# Altium schematic sheet pca10040_sheet4_connectors.SchDoc: PCA10040 - Connectors
size A3; Revision: 1.1.1; SheetNumber: 4; SheetTotal: 5; DrawnBy: KJP; ProjectNumber: 4397; PCAName: PCA10040; PCBRevision: 0071KJP; DocumentSize: A3; PCBNumber: 400150; ProjectName: Quark
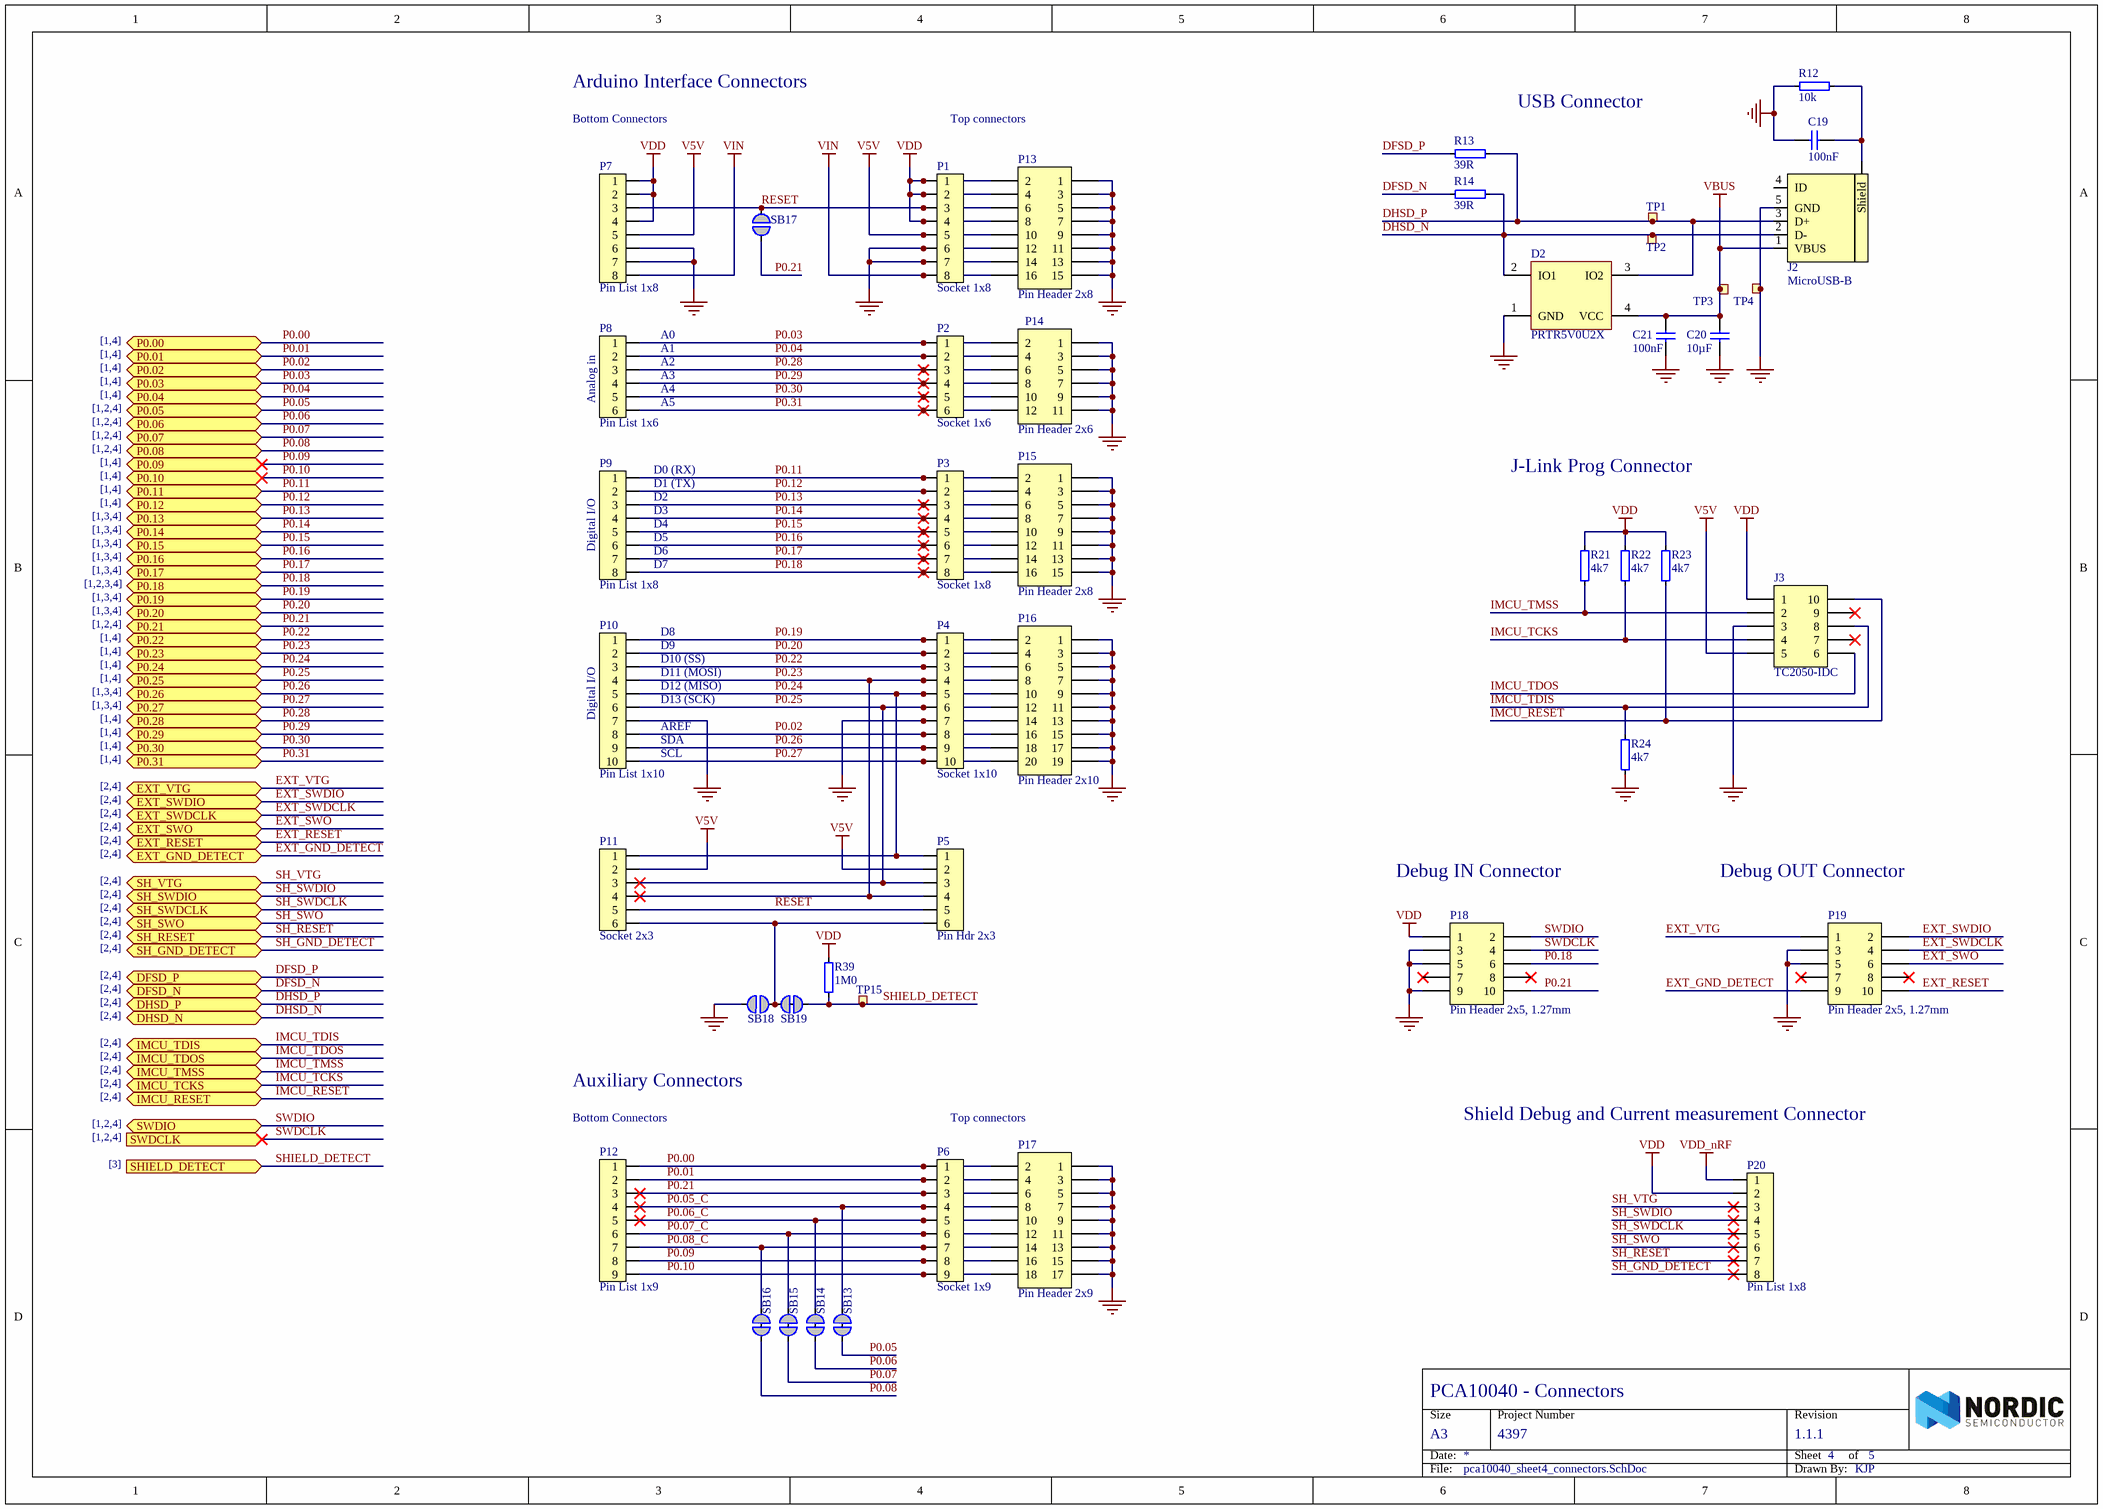
[diagram p0: pca10040_sheet4_connectors.SchDoc]

## Parts
C19  100nF  [CAPC1005X04L]
C20  10µF  [CAPC1608X06L]
C21  100nF  [CAPC1005X04L]
D2  PRTR5V0U2X  [SOT190P230X110-4L]
J2  MicroUSB-B  [USB-Micro-B-RA-SMD-PiP]
J3  TC2050-IDC  [TC2050-IDC-NLFP]  (no BOM)
P1  Socket 1x8  [SOCKET_1x8_SMD]
P2  Socket 1x6  [SOCKET_1x6_SMD]
P3  Socket 1x8  [SOCKET_1x8_SMD]
P4  Socket 1x10  [SOCKET_1x10_SMD]
P5  Pin Hdr 2x3  [HDR_2x3-SMD]
P6  Socket 1x9  [SOCKET_1x9_SMD]
P7  Pin List 1x8  [LIST_1x8_SMD]
P8  Pin List 1x6  [LIST_1x6_SMD]
P9  Pin List 1x8  [LIST_1x8_SMD]
P10  Pin List 1x10  [LIST_1x10_SMD]
P11  Socket 2x3  [SOCKET_2x3_SMD-2.54mm-bottom]
P12  Pin List 1x9  [LIST_1x9_SMD]
P13  Pin Header 2x8  [HDR_2x8]
P14  Pin Header 2x6  [HDR_2x6]
P15  Pin Header 2x8  [HDR_2x8]
P16  Pin Header 2x10  [HDR_2x10]
P17  Pin Header 2x9  [HDR_2x9]
P18  Pin Header 2x5, 1.27mm  [HDR_2x5-SMD-1.27mm-K]
P19  Pin Header 2x5, 1.27mm  [HDR_2x5-SMD-1.27mm-K]
P20  Pin List 1x8  [LIST_1x8_SMD]
R12  10k  [RESC1005X04L]
R13  39R  [RESC1005X04L]
R14  39R  [RESC1005X04L]
R21  4k7  [RESC1005X04L]
R22  4k7  [RESC1005X04L]
R23  4k7  [RESC1005X04L]
R24  4k7  [RESC1005X04L]
R39  1M0  [RESC1005X04L]
SB13  Solderbridge  [Solderbridge_Shorted]  (value not drawn)  (net tie, no BOM)
SB14  Solderbridge  [Solderbridge_Shorted]  (value not drawn)  (net tie, no BOM)
SB15  Solderbridge  [Solderbridge_Shorted]  (value not drawn)  (net tie, no BOM)
SB16  Solderbridge  [Solderbridge_Shorted]  (value not drawn)  (net tie, no BOM)
SB17  Solderbridge  [Solderbridge]  (value not drawn)  (no BOM)
SB18  Solderbridge  [Solderbridge]  (value not drawn)  (no BOM)
SB19  Solderbridge  [Solderbridge_Shorted]  (value not drawn)  (net tie, no BOM)
TP1  Ø1.0mm,SMD  [TP_SMD_Ø1.0mm]  (value not drawn)  (no BOM)
TP2  Ø1.0mm,SMD  [TP_SMD_Ø1.0mm]  (value not drawn)  (no BOM)
TP3  Ø1.0mm,SMD  [TP_SMD_Ø1.0mm]  (value not drawn)  (no BOM)
TP4  Ø1.0mm,SMD  [TP_SMD_Ø1.0mm]  (value not drawn)  (no BOM)
TP15  Ø1.0mm,SMD  [TP_SMD_Ø1.0mm]  (value not drawn)  (no BOM)

## Ports
DFSD_N (bidir), DFSD_P (bidir), DHSD_N (bidir), DHSD_P (bidir), EXT_GND_DETECT (bidir), EXT_RESET (bidir), EXT_SWDCLK (bidir), EXT_SWDIO (bidir), EXT_SWO (bidir), EXT_VTG (bidir), IMCU_RESET (bidir), IMCU_TCKS (bidir), IMCU_TDIS (bidir), IMCU_TDOS (bidir), IMCU_TMSS (bidir), P0.00 (bidir), P0.01 (bidir), P0.02 (bidir), P0.03 (bidir), P0.04 (bidir), P0.05 (bidir), P0.06 (bidir), P0.07 (bidir), P0.08 (bidir), P0.09 (bidir), P0.10 (bidir), P0.11 (bidir), P0.12 (bidir), P0.13 (bidir), P0.14 (bidir), P0.15 (bidir), P0.16 (bidir), P0.17 (bidir), P0.18 (bidir), P0.19 (bidir), P0.20 (bidir), P0.21 (bidir), P0.22 (bidir), P0.23 (bidir), P0.24 (bidir), P0.25 (bidir), P0.26 (bidir), P0.27 (bidir), P0.28 (bidir), P0.29 (bidir), P0.30 (bidir), P0.31 (bidir), SH_GND_DETECT (bidir), SH_RESET (bidir), SH_SWDCLK (bidir), SH_SWDIO (bidir), SH_SWO (bidir), SH_VTG (bidir), SHIELD_DETECT (in), SWDCLK (in), SWDIO (bidir)

## Nets
GND: C19.1 C20.1 C21.1 D2.1(GND) J2.5(GND) J3.3 P1.6 P1.7 P4.7 P7.6 P7.7 P10.7 P13.1 P13.3 P13.5 P13.7 P13.9 P13.11 P13.12 P13.13 P13.14 P13.15 P14.1 P14.3 P14.5 P14.7 P14.9 P14.11 P15.1 P15.3 P15.5 P15.7 P15.9 P15.11 P15.13 P15.15 P16.1 P16.3 P16.5 P16.7 P16.9 P16.11 P16.13 P16.14 P16.15 P16.17 P16.19 P17.1 P17.3 P17.5 P17.7 P17.9 P17.11 P17.13 P17.15 P17.17 P18.3 P18.5 P18.9 P19.3 P19.5 R12.1 R24.2 SB18.1 TP4.1
V5V: J3.5 P1.5 P5.2 P7.5 P11.2 P13.10
VBUS: C20.2 C21.2 D2.4(VCC) J2.1(VBUS) TP3.1
VDD: J3.1 P1.1 P1.2 P1.4 P7.1 P7.2 P7.4 P13.2 P13.4 P13.8 P18.1 P20.2 R21.2 R22.2 R23.2 R39.2
VDD_nRF: P20.1
VIN: P1.8 P7.8 P13.16
DFSD_N: R14.1 ; port DFSD_N
DFSD_P: R13.1 ; port DFSD_P
DHSD_N: D2.2(IO1) J2.2(D-) R14.2 TP2.1 ; port DHSD_N
DHSD_P: D2.3(IO2) J2.3(D+) R13.2 TP1.1 ; port DHSD_P
EXT_GND_DETECT: P19.9 ; port EXT_GND_DETECT
EXT_RESET: P19.10 ; port EXT_RESET
EXT_SWDCLK: P19.4 ; port EXT_SWDCLK
EXT_SWDIO: P19.2 ; port EXT_SWDIO
EXT_SWO: P19.6 ; port EXT_SWO
EXT_VTG: P19.1 ; port EXT_VTG
IMCU_RESET: J3.10 R23.1 ; port IMCU_RESET
IMCU_TCKS: J3.4 R22.1 ; port IMCU_TCKS
IMCU_TDIS: J3.8 R24.1 ; port IMCU_TDIS
IMCU_TDOS: J3.6 ; port IMCU_TDOS
IMCU_TMSS: J3.2 R21.1 ; port IMCU_TMSS
P0.00: P6.1 P12.1 P17.2 ; port P0.00
P0.01: P6.2 P12.2 P17.4 ; port P0.01
P0.02: P4.8 P10.8 P16.16 ; port P0.02
P0.03: P2.1 P8.1 P14.2 ; port P0.03
P0.04: P2.2 P8.2 P14.4 ; port P0.04
P0.05: SB13.2 ; port P0.05
P0.05_C: P6.4 P12.4 P17.8 SB13.1
P0.06: SB14.2 ; port P0.06
P0.06_C: P6.5 P12.5 P17.10 SB14.1
P0.07: SB15.2 ; port P0.07
P0.07_C: P6.6 P12.6 P17.12 SB15.1
P0.08: SB16.2 ; port P0.08
P0.08_C: P6.7 P12.7 P17.14 SB16.1
P0.09: P6.8 P12.8 P17.16 ; port P0.09
P0.10: P6.9 P12.9 P17.18 ; port P0.10
P0.11: P3.1 P9.1 P15.2 ; port P0.11
P0.12: P3.2 P9.2 P15.4 ; port P0.12
P0.13: P3.3 P9.3 P15.6 ; port P0.13
P0.14: P3.4 P9.4 P15.8 ; port P0.14
P0.15: P3.5 P9.5 P15.10 ; port P0.15
P0.16: P3.6 P9.6 P15.12 ; port P0.16
P0.17: P3.7 P9.7 P15.14 ; port P0.17
P0.18: P3.8 P9.8 P15.16 P18.6 ; port P0.18
P0.19: P4.1 P10.1 P16.2 ; port P0.19
P0.20: P4.2 P10.2 P16.4 ; port P0.20
P0.21: P6.3 P12.3 P17.6 P18.10 SB17.2 ; port P0.21
P0.22: P4.3 P10.3 P16.6 ; port P0.22
P0.23: P4.4 P5.4 P10.4 P11.4 P16.8 ; port P0.23
P0.24: P4.5 P5.1 P10.5 P11.1 P16.10 ; port P0.24
P0.25: P4.6 P5.3 P10.6 P11.3 P16.12 ; port P0.25
P0.26: P4.9 P10.9 P16.18 ; port P0.26
P0.27: P4.10 P10.10 P16.20 ; port P0.27
P0.28: P2.3 P8.3 P14.6 ; port P0.28
P0.29: P2.4 P8.4 P14.8 ; port P0.29
P0.30: P2.5 P8.5 P14.10 ; port P0.30
P0.31: P2.6 P8.6 P14.12 ; port P0.31
RESET: P1.3 P5.5 P7.3 P11.5 P13.6 SB17.1
SH_GND_DETECT: P20.8 ; port SH_GND_DETECT
SH_RESET: P20.7 ; port SH_RESET
SH_SWDCLK: P20.5 ; port SH_SWDCLK
SH_SWDIO: P20.4 ; port SH_SWDIO
SH_SWO: P20.6 ; port SH_SWO
SH_VTG: P20.3 ; port SH_VTG
SHIELD_DETECT: R39.1 SB19.2 TP15.1 ; port SHIELD_DETECT
SWDCLK: P18.4 ; port SWDCLK
SWDIO: P18.2 ; port SWDIO
NetC19_2: C19.2 J2.6(Shield) R12.2
NetP5_6: P5.6 P11.6 SB18.2 SB19.1

Not connected (* = marked no-connect by the designer): J2 4(ID); J3 7* 9*; P18 7* 8*; P19 7* 8*

## Notes on the sheet
- Arduino Interface Connectors
- (near R13) USB Connector
- Bottom Connectors
- Top connectors
- [1,4]
- (near P8) A0
- (near P8) A1
- (near P8) A2
- (near P8) A3
- [1,2,4]
- (near P8) Analog in
- (near P8) A4
- (near P8) A5
- [1,3,4]
- (near P9) D0 (RX)
- (near P9) D1 (TX)
- (near P9) D2
- (near P9) D3
- J-Link Prog Connector
- [1,2,3,4]
- (near P9) Digital I/O
- (near P9) D4
- (near P9) D5
- (near P9) D6
- (near P9) D7
- (near P10) D8
- (near P10) D9
- (near P10) Digital I/O
- (near P10) D10 (SS)
- (near P10) D11 (MOSI)
- (near P10) D12 (MISO)
- (near P10) D13 (SCK)
- [2,4]
- (near P10) AREF
- (near P10) SDA
- (near P10) SCL
- Debug IN Connector
- Debug OUT Connector
- Auxiliary Connectors
- (near P12) Bottom Connectors
- Shield Debug and Current measurement Connector
- [3]
- Size
- Date:
- Project Number
- Sheet         of
- Revision
- File:
- Drawn By:

## Library data of the parts
C19 C21 = C0402-100n: Capacitor, X7R, ±10%; Note: 16V; Artikkelnr Noca: 20039200; Artikkelnr Simpro: N.A.; Part Number: C0402-100n; Manufacturer: *; Manufacturer Part Number: *; Datasheet: *; LatestRevisionDate: 2009-11-23; Pin Count: 2; Publisher: Nordic Semiconductor; Published: 2009-05-08; Value: 100nF; Supplier: *; Supplier part number: *; 2nd source Supplier: *; 2nd source part number: *; Footprint Doc: 0402
C20 = C0603-10µ: Capacitor, X5R, ±20%; Note: 6.3V; Artikkelnr Noca: 20039234; Artikkelnr Simpro: N.A.; Part Number: C0603-10µ; Manufacturer: *; Manufacturer Part Number: *; Datasheet: *; LatestRevisionDate: 2011-01-17; Pin Count: 2; Publisher: Nordic Semiconductor; Published: 2011-01-17; Value: 10µF; Supplier: *; Supplier part number: *; 2nd source Supplier: *; 2nd source part number: *; Footprint Doc: 0603
D2 = PRTR5V0U2X: Ultra low capacitance double rail-to-rail ESD protection diode; Manufacturer: NXP; 2nd source part number: 152-4157; Artikkelnr Noca: 10069015; Artikkelnr Simpro: N.A.; Part Number: PRTR5V0U2X; Manufacturer Part Number: PRTR5V0U2X; Datasheet: http://www.farnell.com/datasheets/109718.pdf; LatestRevisionDate: 2012-06-11; Publisher: Nordic Semiconductor; Published: 2012-06-11; Value: PRTR5V0U2X; Note: *; Supplier: Digi-Key; Supplier part number: 568-4140-1-ND; 2nd source Supplier: Farnell; Footprint Doc: SOT-143B
J2 = USB-Micro-B-RA-SMD-PiP: MicroUSB-B-SMT; Manufacturer: Allen Creations Corp.; Manufacturer Part Number: AJU55-BS2111-L; 2nd source part number: 609-4616-1-ND; Artikkelnr Noca: 55029020; Artikkelnr Simpro: N.A.; Part Number: USB-Micro-B-RA-SMD-PiP; Datasheet: \\hizz\pro\app9717\Datasheet\connectores\Allen Creations Corp\AJU-211.pdf; Footprint Doc: USB-Micro-B-RA-SMD-PiP; LatestRevisionDate: 2016-04-21; Pin Count: 5; Publisher: Nordic Semiconductor; Published: 2014-10-07; Value: MicroUSB-B; Note: *; Supplier: Cabcon; Supplier part number: AJU55-BS2111-L; 2nd source Supplier: Digi-Key
J3 = TC2050-IDC-NLFP: CBL PLUG-OF-NAILS 10-PIN; Manufacturer: Tag-Connect LLC; Artikkelnr Noca: N.A.; Part Number: TC2050-IDC-NLFP; Manufacturer Part Number: TC2050-IDC-NLFP; Datasheet: http://www.tag-connect.com/Materials/TC2050-IDC%20Datasheet.pdf; LatestRevisionDate: 2012-11-21; Publisher: Nordic Semiconductor; Published: 2012-11-21; Value: TC2050-IDC; Supplier: Digi-Key; Supplier part number: TC2050-IDC-NL-ND; 2nd source Supplier: *; 2nd source part number: *; Pin Count: 10; Footprint Doc: TC2050-IDC-NLFP; Artikkelnr Simpro: N.A.
P1 P3 = Socket 1x8 SMD: Socket 1x8, 2.54mm (100mil), SMD; Manufacturer: WCON; Manufacturer Part Number: 2171-108MS0CUNR1; 2nd source part number: SSM-108-F-SV-P-TR; Artikkelnr Noca: 55030002; Artikkelnr Simpro: N.A.; Part Number: Socket 1x8 SMD; Datasheet: *; Footprint Doc: SOCKET_1x8_SMD; LatestRevisionDate: 2016-01-22; Pin Count: 8; Publisher: Nordic Semiconductor; Published: 2016-01-22; Value: Socket 1x8; Note: *; Supplier: Cabcon; Supplier part number: 2171-108MS0CUNR1; 2nd source Supplier: Samtec
P2 = Socket 1x6 SMD: Socket 1x6, 2.54mm (100mil), SMD; Manufacturer: WCON; Manufacturer Part Number: 2171-106MS0CUNR1; 2nd source part number: SSM-106-F-SV-P-TR; Artikkelnr Noca: 55030001; Artikkelnr Simpro: N.A.; Part Number: Socket 1x6 SMD; Datasheet: *; Footprint Doc: SOCKET_1x6_SMD; LatestRevisionDate: 2016-01-22; Pin Count: 6; Publisher: Nordic Semiconductor; Published: 2016-01-22; Value: Socket 1x6; Note: *; Supplier: Cabcon; Supplier part number: 2171-106MS0CUNR1; 2nd source Supplier: Samtec
P4 = Socket 1x10 SMD: Socket 1x10, 2.54mm (100mil), SMD; Manufacturer: WCON; Manufacturer Part Number: 2171-110MS0CUNR1; 2nd source part number: SSM-110-F-SV-P-TR; Artikkelnr Noca: 55030004; Artikkelnr Simpro: N.A.; Part Number: Socket 1x10 SMD; Datasheet: *; Footprint Doc: SOCKET_1x10_SMD; LatestRevisionDate: 2016-01-22; Pin Count: 10; Publisher: Nordic Semiconductor; Published: 2016-01-22; Value: Socket 1x10; Note: *; Supplier: Cabcon; Supplier part number: 2171-110MS0CUNR1; 2nd source Supplier: Samtec
P5 = Pin Header 2x3 SMD: Pin Header 2x3, 2.54mm (100mil) SMD; Manufacturer: WCON; Manufacturer Part Number: 1125-1203S0M116R1; 2nd source part number: TSM-103-01-L-DV; Artikkelnr Noca: 55010007; Artikkelnr Simpro: N.A.; Part Number: Pin Header 2x3 SMD; Datasheet: \\hizz\pro\app9717\Datasheet\connectores\W-CON\1125-12XXXXMXXXXX.PDF; Footprint Doc: HDR_2x3-SMD; LatestRevisionDate: 2016-01-22; Pin Count: 6; Publisher: Nordic Semiconductor; Published: 2016-01-22; Value: Pin Hdr 2x3; Note: SMD; Supplier: Cabcon; Supplier part number: 1125-1203S0M116R1; 2nd source Supplier: Samtec
P6 = Socket 1x9 SMD: Socket 1x9, 2.54mm (100mil), SMD; Manufacturer: WCON; Manufacturer Part Number: 2171-109MS0CUNR1; 2nd source part number: SSM-109-L-SV; Artikkelnr Noca: 55030003; Artikkelnr Simpro: N.A.; Part Number: Socket 1x9 SMD; Datasheet: *; Footprint Doc: SOCKET_1x9_SMD; LatestRevisionDate: 2016-01-22; Pin Count: 9; Publisher: Nordic Semiconductor; Published: 2016-01-22; Value: Socket 1x9; Note: *; Supplier: Cabcon; Supplier part number: 2171-109MS0CUNR1; 2nd source Supplier: Samtec
P7 P9 = Pin List 1x8 SMD: Pin List 1x8, 2.54mm (100mil), SMD; Note: Not mounted; Artikkelnr Noca: 55019253; Artikkelnr Simpro: N.A.; Part Number: Pin List 1x8 SMD; Manufacturer: *; Manufacturer Part Number: *; Datasheet: *; LatestRevisionDate: 2013-08-27; Publisher: Nordic Semiconductor; Published: 2013-08-27; Value: Pin List 1x8; Supplier: Samtec; Supplier part number: TSM-108-01-L-SV-P-TR; 2nd source Supplier: *; 2nd source part number: *; Pin Count: 8; Footprint Doc: LIST_1x8_SMD
P8 = Pin List 1x6 SMD: Pin List 1x6, 2.54mm (100mil), SMD; Note: Not mounted; Artikkelnr Noca: 55019252; Artikkelnr Simpro: N.A.; Part Number: Pin List 1x6 SMD; Manufacturer: *; Manufacturer Part Number: *; Datasheet: *; LatestRevisionDate: 2013-08-27; Pin Count: 6; Publisher: Nordic Semiconductor; Published: 2013-08-27; Value: Pin List 1x6; Supplier: Samtec; Supplier part number: TSM-106-01-L-SV-P-TR; 2nd source Supplier: *; 2nd source part number: *; Footprint Doc: LIST_1x6_SMD
P10 = Pin List 1x10 SMD: Pin List 1x10, 2.54mm (100mil), SMD; Note: Not mounted; Artikkelnr Noca: 55019254; Artikkelnr Simpro: N.A.; Part Number: Pin List 1x10 SMD; Manufacturer: *; Manufacturer Part Number: *; Datasheet: *; LatestRevisionDate: 2013-08-27; Publisher: Nordic Semiconductor; Published: 2013-08-27; Value: Pin List 1x10; Supplier: Samtec; Supplier part number: TSM-110-01-L-SV-P-TR; 2nd source Supplier: *; 2nd source part number: *; Pin Count: 10; Footprint Doc: LIST_1x10_SMD
P11 = Socket 2x3 SMD Bottom: Socket 2x3, 2.54mm (100mil), SMD; Manufacturer: Samtec; Manufacturer Part Number: SSM-103-F-DV-P-TR; 2nd source part number: S5712-ND; Note: Not mounted; Artikkelnr Noca: 55019255; Artikkelnr Simpro: N.A.; Part Number: Socket 2x3 SMD Bottom; Datasheet: http://www.samtec.com/documents/webfiles/pdf/SSM_SM.PDF; LatestRevisionDate: 2014-06-10; Pin Count: 6; Publisher: Nordic Semiconductor; Published: 2014-06-10; Value: Socket 2x3; Supplier: Samtec; Supplier part number: SSM-103-F-DV-P-TR; 2nd source Supplier: Digi-Key; Footprint Doc: SOCKET_2x3_SMD-2.54mm-bottom
P12 = Pin List 1x9 SMD: Pin List 1x9, 2.54mm (100mil), SMD; Artikkelnr Noca: N.A.; Part Number: Pin List 1x9 SMD; Manufacturer: *; Manufacturer Part Number: *; Datasheet: *; Footprint Doc: LIST_1x9_SMD; LatestRevisionDate: 2014-06-10; Pin Count: 9; Publisher: Nordic Semiconductor; Published: 2014-06-10; Value: Pin List 1x9; Note: *; Supplier: Samtec; Supplier part number: TSM-109-01-L-SV-P-TR; 2nd source Supplier: *; 2nd source part number: *; Artikkelnr Simpro: N.A.
P13 P15 = Pin Header 2x8: Pin Header 2x8, 2.54mm (100mil); Note: Not mounted; Artikkelnr Noca: N.A.; Part Number: Pin Header 2x8; Manufacturer: *; Manufacturer Part Number: *; Datasheet: *; Footprint Doc: HDR_2x8; LatestRevisionDate: 2009-12-12; Pin Count: 16; Publisher: Nordic Semiconductor; Published: 2009-12-12; Value: Pin Header 2x8; Supplier: *; Supplier part number: *; 2nd source Supplier: *; 2nd source part number: *; Artikkelnr Simpro: N.A.
P14 = Pin Header 2x6: Pin Header 2x6, 2.54mm (100mil); Note: Not mounted; Artikkelnr Noca: N.A.; Part Number: Pin Header 2x6; Manufacturer: *; Manufacturer Part Number: *; Datasheet: *; Footprint Doc: HDR_2x6; LatestRevisionDate: 2014-07-04; Pin Count: 12; Publisher: Nordic Semiconductor; Published: 2009-12-12; Value: Pin Header 2x6; Supplier: *; Supplier part number: *; 2nd source Supplier: *; 2nd source part number: *; Artikkelnr Simpro: N.A.
P16 = Pin Header 2x10: Pin Header 2x10, 2.54mm (100mil); Note: Not mounted; Artikkelnr Noca: N.A.; Part Number: Pin Header 2x10; Manufacturer: *; Manufacturer Part Number: *; Datasheet: *; Footprint Doc: HDR_2x10; LatestRevisionDate: 2014-07-04; Pin Count: 20; Publisher: Nordic Semiconductor; Published: 2009-12-12; Value: Pin Header 2x10; Supplier: *; Supplier part number: *; 2nd source Supplier: *; 2nd source part number: *; Artikkelnr Simpro: N.A.
P17 = Pin Header 2x9: Pin Header 2x9, 2.54mm (100mil); Artikkelnr Noca: N.A.; Part Number: Pin Header 2x9; Manufacturer: *; Manufacturer Part Number: *; Datasheet: *; Footprint Doc: HDR_2x9; LatestRevisionDate: 2011-07-06; Pin Count: 18; Publisher: Nordic Semiconductor; Published: 2011-07-06; Value: Pin Header 2x9; Note: *; Supplier: *; Supplier part number: *; 2nd source Supplier: *; 2nd source part number: *; Artikkelnr Simpro: N.A.
P18 P19 = Pin Header 2x5 SMD, 1.27mm, KS: Pin Header 2x5, 1.27mm (50mil), SMD, Keying Shroud; Manufacturer: WCON; Manufacturer Part Number: 3132-10MS0BK00R1; 2nd source part number: FTSH-105-01-F-DV-K; Artikkelnr Noca: 55010009; Artikkelnr Simpro: N.A.; Part Number: Pin Header 2x5 SMD, 1.27mm, KS; Datasheet: \\hizz\pro\app9717\Datasheet\connectores\W-CON\3132-XXMXXBK00XX.pdf; Footprint Doc: HDR_2x5-SMD-1.27mm; LatestRevisionDate: 2016-04-21; Pin Count: 10; Publisher: Nordic Semiconductor; Published: 2016-01-22; Value: Pin Header 2x5, 1.27mm; Note: *; Supplier: Cabcon; Supplier part number: 3132-10MS0BK00R1; 2nd source Supplier: Samtec
P20 = Pin List 1x8 SMD: Pin List 1x8, 2.54mm (100mil), SMD; Manufacturer: WCON; Manufacturer Part Number: 1125-1108S0M116R2; 2nd source part number: TSM-108-01-L-SV-P-TR; Artikkelnr Noca: 55010006; Artikkelnr Simpro: N.A.; Part Number: Pin List 1x8 SMD; Datasheet: \\hizz\pro\app9717\Datasheet\connectores\W-CON\1125-11XXXXMXXXXX.pdf; Footprint Doc: LIST_1x8_SMD; LatestRevisionDate: 2016-01-22; Pin Count: 8; Publisher: Nordic Semiconductor; Published: 2016-01-22; Value: Pin List 1x8; Note: *; Supplier: Cabcon; Supplier part number: 1125-1108S0M116R2; 2nd source Supplier: Samtec
R12 = R0402-10k: Resistor, ±1%, 0.063W; Note: Chip Res 1%; Artikkelnr Noca: 27049097; Artikkelnr Simpro: N.A.; Value: 10k; Part Number: R0402-10k; Manufacturer: *; Manufacturer Part Number: *; Datasheet: *; LatestRevisionDate: 2009-11-23; Pin Count: 2; Publisher: Nordic Semiconductor; Published: 2009-05-08; Supplier: Farnell; Supplier part number: 173-8864; 2nd source Supplier: *; 2nd source part number: *; Footprint Doc: 0402
R13 R14 = R0402-39R: Resistor, ±1%, 0.063W; Note: Chip Res 1%; Artikkelnr Noca: 27049039; Artikkelnr Simpro: N.A.; Value: 39R; Part Number: R0402-39R; Manufacturer: *; Manufacturer Part Number: *; Datasheet: *; LatestRevisionDate: 2009-11-23; Pin Count: 2; Publisher: Nordic Semiconductor; Published: 2009-05-08; Supplier: Farnell; Supplier part number: 173-8831; 2nd source Supplier: *; 2nd source part number: *; Footprint Doc: 0402
R21-R24 = R0402-4k7: Resistor, ±1%, 0.063W; Note: Chip Res 1%; Artikkelnr Noca: 27049089; Artikkelnr Simpro: N.A.; Part Number: R0402-4k7; Manufacturer: *; Manufacturer Part Number: *; Datasheet: *; LatestRevisionDate: 2009-11-23; Pin Count: 2; Publisher: Nordic Semiconductor; Published: 2009-05-08; Value: 4k7; Supplier: Farnell; Supplier part number: 173-8858; 2nd source Supplier: *; 2nd source part number: *; Footprint Doc: 0402
R39 = R0402-1M0: Resistor, ±1%, 0.063W; Note: Chip Res 1%; Artikkelnr Noca: 27049145; Artikkelnr Simpro: N.A.; Part Number: R0402-1M0; Manufacturer: *; Manufacturer Part Number: *; Datasheet: *; Footprint Doc: 0402; LatestRevisionDate: 2009-11-23; Pin Count: 2; Publisher: Nordic Semiconductor; Published: 2009-05-08; Value: 1M0; Supplier: *; Supplier part number: *; 2nd source Supplier: *; 2nd source part number: *
SB13-SB16 SB19 = Solderbridge Shorted: Shorted Solderbridge; Artikkelnr Noca: N.A.; Part Number: Solderbridge Shorted; Manufacturer: *; Manufacturer Part Number: *; Datasheet: *; Footprint Doc: Solderbridge_Shorted; LatestRevisionDate: 2012-08-07; Pin Count: 2; Publisher: Nordic Semiconductor; Published: 2012-08-07; Value: Solderbridge; Note: *; Supplier: *; Supplier part number: *; 2nd source Supplier: *; 2nd source part number: *; Artikkelnr Simpro: N.A.
SB17 SB18 = Solderbridge: Artikkelnr Noca: N.A.; Part Number: Solderbridge; Manufacturer: *; Manufacturer Part Number: *; Datasheet: *; Footprint Doc: Solderbridge; LatestRevisionDate: 2009-12-14; Pin Count: 2; Publisher: Nordic Semiconductor; Published: 2009-12-14; Value: Solderbridge; Note: *; Supplier: *; Supplier part number: *; 2nd source Supplier: *; 2nd source part number: *; Artikkelnr Simpro: N.A.
TP1-TP4 TP15 = TP_SMD_Ø1.0MM: 1.0mm circular SMD testpad; Manufacturer: Nordic Semiconductor; Artikkelnr Noca: N.A.; Part Number: TP_SMD_Ø1.0MM; Manufacturer Part Number: *; Datasheet: *; LatestRevisionDate: 2013-06-11; Pin Count: 1; Publisher: Nordic Semiconductor; Published: 2013-06-11; Value: Ø1.0mm,SMD; Note: *; Supplier: *; Supplier part number: *; 2nd source Supplier: *; 2nd source part number: *; Footprint Doc: TP_SMD_Ø1.0mm; Artikkelnr Simpro: N.A.